# Altium project RFPA_PREAMP.PrjPcb
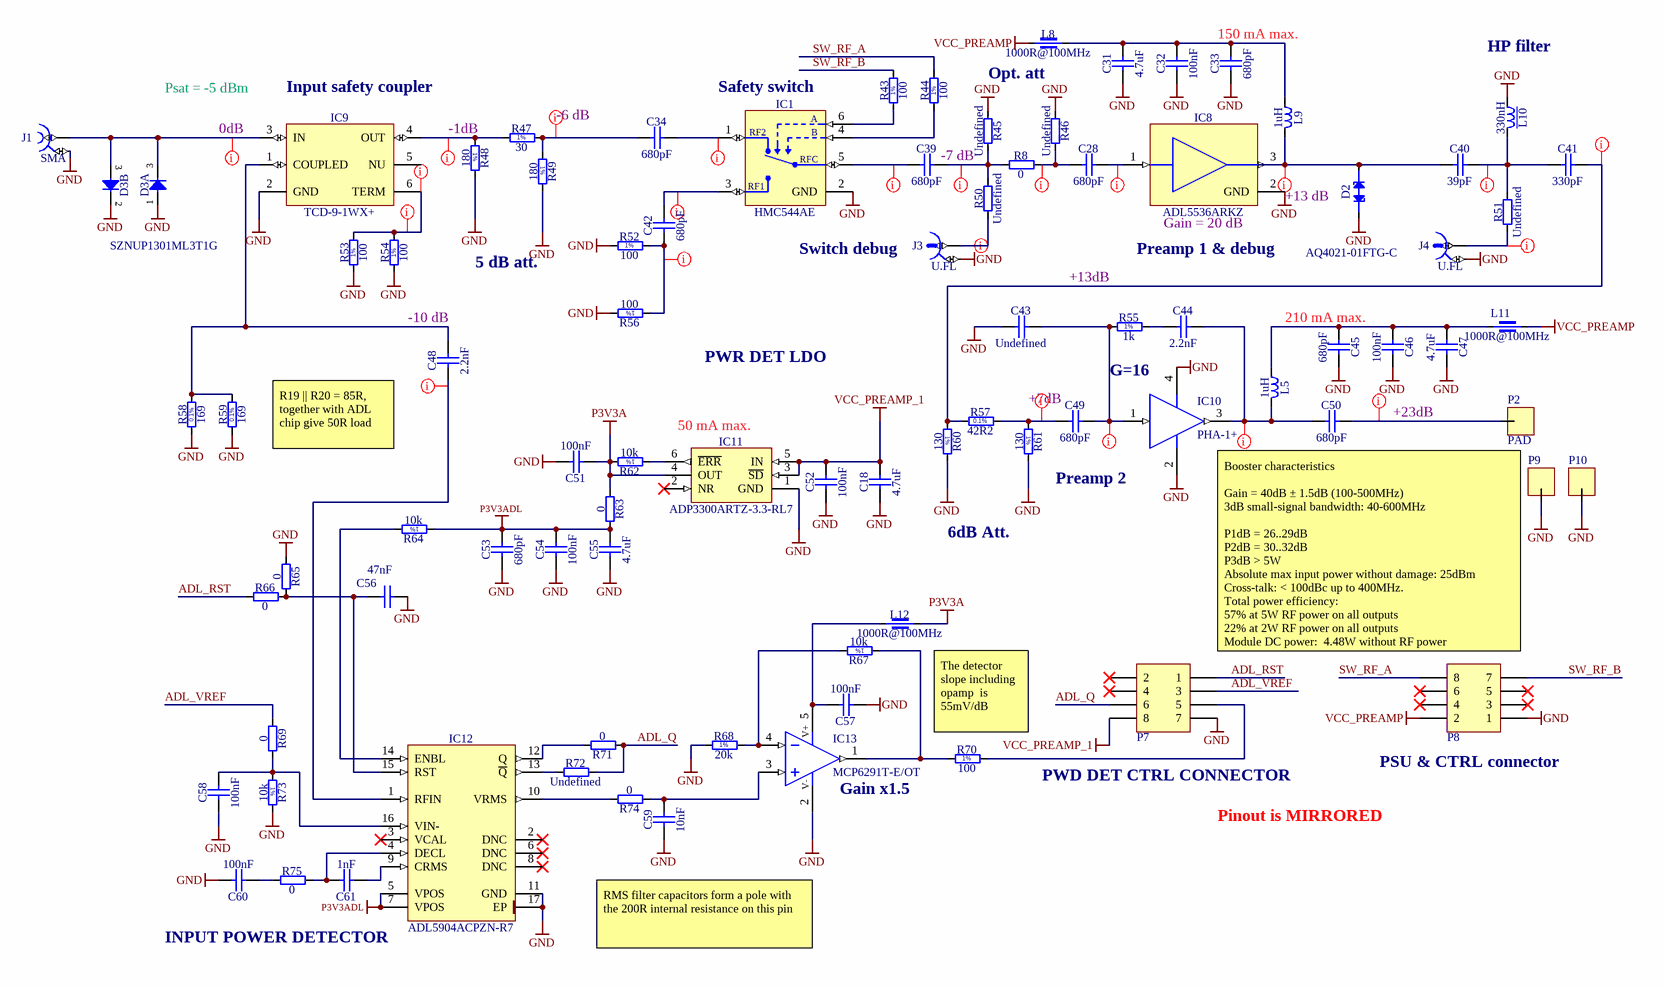
[diagram p0: Booster_PA_PREAMP.SchDoc]
1 sheet, 86 parts. Net scope: global (net labels, ports and power ports of the same name join across sheets).
Board file: Booster_PA_PREAMP.PcbDoc

## Sheet Booster_PA_PREAMP.SchDoc: Booster
size 420 x 297 mm; Comments: Preamplifier circuit design for RFPA; Wersja: 1.41; CustomerInfo: Technosystem sp. z.o.o; CustomerAddress: ul. Okulickiego 7/9 05-500 Piaseczno, NIP 1231350775; CopyrightBy: Maciej Urbanski; CopyrightDate: 2018; TopSheet: RFPA_PREAMP; CurrentSheet: RFPA_PREAMP; Author: G.Kasprowicz; CompanyName: WUT ISE; DrawnBy: G.Kasprowicz; Organization: WUT ISE; Address1: PW ISE; Address2: Nowowiejska 15/19 00-665 Warsaw; Address3: gkasprow@gmail.com; Revision: 2; SheetNumber: -; SheetTotal: -; ModifiedBy: -; CheckedDate: -; Title2: RF Preamplifier; DivGrp: WUT ISE; Designer: M.U.; ModifiedDate: -; ProjectName: Sensor Box

### Parts
C18  4.7uF  [CAPC1709X95N]
C28  680pF  [CAPC1608X87N]
C31  4.7uF  [CAPC1709X95N]
C32  100nF  [CAPC1608X87N]
C33  680pF  [CAPC1608X87N]
C34  680pF  [CAPC1608X87N]
C39  680pF  [CAPC1608X87N]
C40  39pF  [CAPC1608X87N]
C41  330pF  [CAPC1608X87N]
C42  680pF  [CAPC1608X87N]
C43  Undefined  [CAPC1608X90N]
C44  2.2nF  [CAPC1608X87N]
C45  680pF  [CAPC1608X87N]
C46  100nF  [CAPC1608X87N]
C47  4.7uF  [CAPC1709X95N]
C48  2.2nF  [CAPC1608X87N]
C49  680pF  [CAPC1608X87N]
C50  680pF  [CAPC1608X87N]
C51  100nF  [CAPC1608X87N]
C52  100nF  [CAPC1608X87N]
C53  680pF  [CAPC1608X87N]
C54  100nF  [CAPC1608X87N]
C55  4.7uF  [CAPC1709X95N]
C56  47nF  [CAPC1608X87N]
C57  100nF  [CAPC1608X87N]
C58  100nF  [CAPC1608X87N]
C59  10nF  [CAPC1005X55N]
C60  100nF  [CAPC1608X87N]
C61  1nF  [CAPC1005X55N]
D2  AQ4021-01FTG-C  [SOD2513X114N]
D3  SZNUP1301ML3T1G  [SOT95P240X110-3N]  (value not drawn)  (parts A,B of 2)
IC1  HMC544AE  [SOT95P280X145-6N]
IC8  ADL5536ARKZ  [ANALOG-DEVICES_SOT-89(RK-3)]
IC9  TCD-9-1WX+  [MINI-CIRCUITS_DB1627]
IC10  PHA-1+  [MINI-CIRCUITS_DF782]
IC11  ADP3300ARTZ-3.3-RL7  [SOT95P280X145-6N]
IC12  ADL5904ACPZN-R7  [QFN50P300X300X80-17N-S175]
IC13  MCP6291T-E/OT  [SOT95P270X145-5N]
J1  SMA  [LINK_CONSMA002-SMD-G]
J3  U.FL  [HIROSE_U.FL-R-SMT-1(10)]
J4  U.FL  [HIROSE_U.FL-R-SMT-1(10)]
L5  1uH  [IND_ABRACON_AISC-1008]
L8  1000R@100MHz  [INDC1608X95N]
L9  1uH  [IND_ABRACON_AISC-1008]
L10  330nH  [IND_COILCRAFT_0603LS]
L11  1000R@100MHz  [INDC1608X95N]
L12  1000R@100MHz  [INDC1608X95N]
P2  PAD  [PAD_2x3_rect]
P7  HDR2X4  [HDR2X4_SMD]  (value not drawn)
P8  HDR2X4  [HDR2X4_SMD]  (value not drawn)
P9  PAD  [PAD_2x3_rect]  (value not drawn)
P10  PAD  [PAD_2x3_rect]  (value not drawn)
R8  0  [RESC1005X40N]
R43  100  [RESC1608X55N]
R44  100  [RESC1608X55N]
R45  Undefined  [RESC1608X55N]
R46  Undefined  [RESC1608X55N]
R47  30  [RESC1608X55N]
R48  180  [RESC1608X55N]
R49  180  [RESC1608X55N]
R50  Undefined  [RESC1608X55N]
R51  Undefined  [RESC1608X55N]
R52  100  [RESC1608X55N]
R53  100  [RESC1608X55N]
R54  100  [RESC1608X55N]
R55  1k  [RESC1608X55N]
R56  100  [RESC1608X55N]
R57  42R2  [RESC1608X55N]
R58  169  [RESC1608X55N]
R59  169  [RESC1608X55N]
R60  130  [RESC1608X55N]
R61  130  [RESC1608X55N]
R62  10k  [RESC1005X40N]
R63  0  [RESC1005X40N]
R64  10k  [RESC1005X40N]
R65  0  [RESC1005X40N]
R66  0  [RESC1005X40N]
R67  10k  [RESC1005X40N]
R68  20k  [RESC1608X55N]
R69  0  [RESC1005X40N]
R70  100  [RESC1608X55N]
R71  0  [RESC1005X40N]
R72  Undefined  [RESC1608X55N]
R73  10k  [RESC1005X40N]
R74  0  [RESC1005X40N]
R75  0  [RESC1005X40N]

### Nets
GND: C18.1 C31.1 C32.1 C33.1 C43.1 C45.1 C46.1 C47.1 C51.2 C52.1 C53.1 C54.1 C55.1 C56.2 C57.1 C58.1 C59.1 C60.2 D2.1(C) D3.1(A) D3.2(C) IC1.2(GND) IC8.2(GND) IC9.2(GND) IC10.2(GND) IC10.4(GND) IC11.1(GND) IC12.11(GND) IC12.17(EP) IC13.2(V-) J1.2 J3.2 J4.2 L10.1 P7.7 P8.1 P9.1 P10.1 R45.1 R46.1 R48.2 R49.2 R52.1 R53.1 R54.1 R56.2 R58.1 R59.1 R60.2 R61.2 R65.1 R68.1 R73.2
P3V3A: C51.1 IC11.4(OUT) L12.2 R62.2 R63.1
P3V3ADL: C53.2 C54.2 C55.2 IC12.5(VPOS) IC12.7(VPOS) R63.2 R64.1
VCC_PREAMP: L8.1 L11.2 P8.2
VCC_PREAMP_1: C18.2 C52.2 IC11.3(~{SD}) IC11.5(IN) P7.8
ADL_Q: P7.6 R71.1 R72.2
ADL_RST: P7.1 R66.1
ADL_VREF: P7.3 R69.1
SW_RF_A: P8.8 R44.2
SW_RF_B: P8.7 R43.2
NetC28_1: C28.1 R8.2 R46.2
NetC28_2: C28.2 IC8.1(RFIN)
NetC31_2: C31.2 C32.2 C33.2 L8.2 L9.1
NetC34_1: C34.1 R47.2 R49.1
NetC34_2: C34.2 IC1.1(RF2)
NetC39_1: C39.1 IC1.5(RFC)
NetC39_2: C39.2 R8.1 R45.2 R50.2
NetC40_1: C40.1 D2.2(A) IC8.3(RFOUT) L9.2
NetC40_2: C40.2 C41.1 L10.2 R51.2
NetC41_2: C41.2 R57.1 R60.1
NetC42_1: C42.1 R52.2 R56.1
NetC42_2: C42.2 IC1.3(RF1)
NetC43_2: C43.2 C49.2 IC10.1(RF_IN) R55.1
NetC44_1: C44.1 R55.2
NetC44_2: C44.2 C50.1 IC10.3(RF_OUT) L5.2
NetC45_2: C45.2 C46.2 C47.2 L5.1 L11.1
NetC48_1: C48.1 IC12.1(RFIN)
NetC48_2: C48.2 IC9.1(COUPLED) R58.2 R59.2
NetC49_1: C49.1 R57.2 R61.1
NetC50_2: C50.2 P2.1
NetC56_1: C56.1 IC12.15(RST) R65.2 R66.2
NetC57_2: C57.2 IC13.5(V+) L12.1
NetC58_2: C58.2 IC12.16(VIN-) R69.2 R73.1
NetC59_2: C59.2 IC13.3(IN+) R74.1
NetC60_1: C60.1 R75.1
NetC61_1: C61.1 IC12.9(CRMS)
NetC61_2: C61.2 IC12.4(DECL) R75.2
NetD3_3: D3.3(COMAC) IC9.3(IN) J1.1
NetIC1_4: IC1.4(B) R44.1
NetIC1_6: IC1.6(A) R43.1
NetIC9_4: IC9.4(OUT) R47.1 R48.1
NetIC9_6: IC9.6(TERM) R53.2 R54.2
NetIC11_6: IC11.6(~{ERR}) R62.1
NetIC12_10: IC12.10(VRMS) R74.2
NetIC12_12: IC12.12(Q) R71.2
NetIC12_13: IC12.13(~{Q}) R72.1
NetIC12_14: IC12.14(ENBL) R64.2
NetIC13_1: IC13.1(OUT) R67.1 R70.1
NetIC13_4: IC13.4(IN-) R67.2 R68.2
NetJ3_1: J3.1 R50.1
NetJ4_1: J4.1 R51.1
NetP7_5: P7.5 R70.2

Not connected (* = marked no-connect by the designer): IC9 5(NU); IC11 2(NR)*; IC12 2(DNC)* 3(VCAL)* 6(DNC)* 8(DNC)*; P7 2* 4*; P8 3* 4* 5* 6*

### Layout directives
net class 50_Ohm: NetC28_1, NetC28_2, NetC34_1, NetC34_2, NetC39_1, NetC39_2, NetC40_1, NetC40_2, NetC41_2, NetC42_1, NetC42_2, NetC43_2, NetC44_2, NetC48_1, NetC49_1, NetC50_2, NetD3_3, NetIC9_4, NetIC9_6, NetJ3_1, NetJ4_1

### Notes on the sheet
- (near IC9) Psat = -5 dBm
- Input safety coupler
- (near IC1) Safety switch
- Opt. att
- (near C33) 150 mA max.
- (near L10) HP filter
- (near IC9) 0dB
- (near R48) -1dB
- -6 dB
- -7 dB
- (near IC8) Gain = 20 dB
- +13 dB
- 5 dB att.
- Switch debug
- +13dB
- Preamp 1 & debug
- (near C48) -10 dB
- PWR DET LDO
- (near C45) 210 mA max.
- 50 mA max.
- +7dB
- (near IC10) G=16
- +23dB
- R19 || R20 = 85R, together with ADL chip give 50R load
- Preamp 2
- 6dB Att.
- Booster characteristics
  Gain = 40dB ± 1.5dB (100-500MHz)
  3dB small-signal bandwidth: 40-600MHz
  P1dB = 26..29dB
  P2dB = 30..32dB
  P3dB > 5W
  Absolute max input power without damage: 25dBm
  Cross-talk: < 100dBc up to 400MHz.
  Total power efficiency:
  57% at 5W RF power on all outputs
  22% at 2W RF power on all outputs
  Module DC power:  4.48W without RF power
- The detector slope including opamp  is 55mV/dB
- (near P8) PSU & CTRL connector
- (near IC13) Gain x1.5
- PWD DET CTRL CONNECTOR
- Pinout is MIRRORED
- INPUT POWER DETECTOR
- RMS filter capacitors form a pole with the 200R internal resistance on this pin
- Project/Equipment
- Document
- Designer
- Drawn by
- Check.by
- Copyright WUT ISE 2019.
  This documentation describes Open Hardware and is licensed under the CERN OHL v.1.1. You may redistribute and modify this documentation under the terms of the CERN OHL v.1.1. (http://ohwr.org/CERNOHL). This documentation is distributed WITHOUT ANY EXPRESS OR IMPLIED WARRANTY, INCLUDING OF MERCHANTABILITY, SATISFACTORY QUALITY AND FITNESS FOR A PARTICULAR PURPOSE. Please see the CERN OHL v.1.1 for applicable conditions.
- Contact
- File
- Last Mod.
- Print Date
- Sheet
- Size
- A3
- of
- Rev
- (in symbol R0402_10k_1%_0.0625W_100PPM) 1%
- (in symbol R0603_1K_1%_0.1W_100PPM) 1%
- (in symbol R0603_20K_1%_0.1W_100PPM) 1%
- (in symbol R0603_30R_1%_0.1W_100PPM) 1%
- (in symbol R0603_42R2_0.1%_0.063W_10PPM) 0.1%
- (in symbol R0603_100R_1%_0.1W_100PPM) 1%
- (in symbol R0603_130R_1%_0.1W_100PPM) 1%
- (in symbol R0603_169R_0.1%_0.063W_10PPM) 0.1%
- (in symbol R0603_180R_1%_0.1W_100PPM) 1%

### Library data of the parts
C18 C31 C47 C55 = CC0603_4.7UF_16V_10%_X5R: Non-polarised capacitor; Manufacturer: GENERIC; Part Description: SMD Multilayer Chip Ceramic Capacitor; Manufacturer1 Part Number: EMK107ABJ475KA-T; Voltage: 16V; TC: X5R; Tolerance: ±10%; Value: 4.7uF; Manufacturer Part Number: CC0603_4.7UF_16V_10%_X5R; Part Number: CC0603_4.7UF_16V_10%_X5R; Component Kind: Standard; Component Type: Standard; Pin Count: 2; Status: None; Case: 0603; Mounted: Yes; Socket: No; SMD: Yes; Sense: No; Manufacturer1 Example: TAIYO YUDEN; Manufacturer1 ComponentHeight: 0.95mm; HelpURL: \\cern.ch\dfs\Applications\Altium\Datasheets\CC0603_X7R_TAIYO-YUDEN_HIGH-VALUE.pdf; Author: CERN DEM JLC; CreateDate: 16.12.2013; LatestRevisionDate: 16.09.2014
C28 C33 C34 C39 C42 = CC0603_680PF_50V_5%_NP0: Non-polarised capacitor; Part Description: SMD Multilayer Chip Ceramic Capacitor; Manufacturer: GENERIC; Manufacturer1 Part Number: 223886715681; Voltage: 50V; TC: C0G/NP0; Tolerance: ±5%; Part Number: CC0603_680PF_50V_5%_NP0; Component Kind: Standard; Component Type: Standard; Pin Count: 2; Value: 680pF; Status: Preferred; Manufacturer Part Number: CC0603_680PF_50V_5%_NP0; Case: 0603; Mounted: Yes; Socket: No; SMD: Yes; Sense: No; Manufacturer1 Example: PHYCOMP; Manufacturer1 ComponentHeight: 0.87mm; HelpURL: \\cern.ch\dfs\Applications\Altium\Datasheets\CC0603_NP0_PHYCOMP.pdf; Author: CERN DEM JLC; CreateDate: 03.12.2007; LatestRevisionDate: 03.12.2007
C32 C46 C51 C52 C54 C57 C58 C60 = CC0603_100NF_50V_10%_X7R: Non-polarised capacitor; Manufacturer: GENERIC; Part Description: SMD Multilayer Chip Ceramic Capacitor; Manufacturer1 Part Number: 223858615649; Voltage: 50V; TC: X7R; Tolerance: ±10%; Value: 100nF; Manufacturer Part Number: CC0603_100NF_50V_10%_X7R; Part Number: CC0603_100NF_50V_10%_X7R; Component Kind: Standard; Component Type: Standard; Pin Count: 2; Status: Preferred; Case: 0603; Mounted: Yes; Socket: No; SMD: Yes; Sense: No; Manufacturer1 Example: PHYCOMP; Manufacturer1 ComponentHeight: 0.87mm; HelpURL: \\cern.ch\dfs\Applications\Altium\Datasheets\CC0603_X7R_PHYCOMP.pdf; Author: CERN DEM JLC; CreateDate: 03.12.2007; LatestRevisionDate: 03.12.2007
C40 = CC0603_39PF_50V_1%_NP0: Non-polarised capacitor; Part Number: CC0603_39PF_100V_1%_NP0; Part Description: SMD Multilayer Chip Ceramic Capacitor; Manufacturer: GENERIC; Manufacturer1 Part Number: 06031A390FAT2A; Voltage: 100V; TC: C0G/NP0; Tolerance: ±1%; Component Kind: Standard; Component Type: Standard; Pin Count: 2; Value: 39pF; Status: Preferred; Manufacturer Part Number: CC0603_39PF_100V_1%_NP0; Case: 0603; Mounted: Yes; Socket: No; SMD: Yes; Sense: No; Manufacturer1 Example: AVX; Manufacturer1 ComponentHeight: 0.87mm; HelpURL: \\cern.ch\dfs\Applications\Altium\Datasheets\CC0603_NP0_PHYCOMP.pdf; Author: GK; CreateDate: 03.12.2007; LatestRevisionDate: 03.12.2007
C41 = CC0603_330PF_50V_1%_NP0: Non-polarised capacitor; Manufacturer: GENERIC; Part Description: SMD Multilayer Chip Ceramic Capacitor; Manufacturer1 Part Number: 223886718331; Voltage: 50V; TC: C0G/NP0; Tolerance: ±1%; Value: 330pF; Manufacturer Part Number: CC0603_330PF_50V_1%_NP0; Part Number: CC0603_330PF_50V_1%_NP0; Component Kind: Standard; Component Type: Standard; Pin Count: 2; Status: None; Case: 0603; Mounted: Yes; Socket: No; SMD: Yes; Sense: No; Manufacturer1 Example: PHYCOMP; Manufacturer1 ComponentHeight: 0.87mm; HelpURL: \\cern.ch\dfs\Applications\Altium\Datasheets\CC0603_NP0_PHYCOMP.pdf; Author: CERN DEM MR; CreateDate: 06.09.2017; LatestRevisionDate: 06.09.2017
C43 = CC0603_NO-VALUE: Non-polarised capacitor; Part Description: Reserved Footprint For 0603(1608) Chip Ceramic Capacitor; Mounted: No; Part Number: CC0603_NO-VALUE; Component Kind: Standard; Component Type: Standard; Pin Count: 2; Value: Undefined; Status: None; Manufacturer: Undefined; Manufacturer Part Number: CC0603_NO-VALUE; Case: 0603; Socket: No; SMD: Yes; Sense: No; Manufacturer1 ComponentHeight: 0.9mm; HelpURL: Undefined; Author: CERN DEM MR; CreateDate: 22.11.2016; LatestRevisionDate: 22.11.2016
C44 C48 = CC0603_2.2NF_50V_5%_C0G: Non-polarised capacitor; Part Description: SMD Multilayer Chip Ceramic Capacitor; Manufacturer: GENERIC; Manufacturer1 Part Number: C1608C0G1H222J080AA; Voltage: 50V; TC: C0G/NP0; Tolerance: ±5%; Part Number: CC0603_2.2NF_50V_5%_C0G; Component Kind: Standard; Component Type: Standard; Pin Count: 2; Value: 2.2nF; Status: Preferred; Manufacturer Part Number: CC0603_2.2NF_50V_5%_C0G; Case: 0603; Mounted: Yes; Socket: No; SMD: Yes; Sense: No; Manufacturer1 Example: TDK; Manufacturer1 ComponentHeight: 0.9mm; HelpURL: \\cern.ch\dfs\Applications\Altium\Datasheets\CC0603_C0G_TDK_C.pdf; Author: CERN DEM JMW; CreateDate: 23.06.2014; LatestRevisionDate: 23.06.2014
C45 C49 C50 C53 = CC0603_680PF_50V_5%_NP0: Non-polarised capacitor; Manufacturer: GENERIC; Part Description: SMD Multilayer Chip Ceramic Capacitor; Manufacturer1 Part Number: 223886715681; Voltage: 50V; TC: C0G/NP0; Tolerance: ±5%; Value: 680pF; Manufacturer Part Number: CC0603_680PF_50V_5%_NP0; Part Number: CC0603_680PF_50V_5%_NP0; Component Kind: Standard; Component Type: Standard; Pin Count: 2; Status: Preferred; Case: 0603; Mounted: Yes; Socket: No; SMD: Yes; Sense: No; Manufacturer1 Example: PHYCOMP; Manufacturer1 ComponentHeight: 0.87mm; HelpURL: \\cern.ch\dfs\Applications\Altium\Datasheets\CC0603_NP0_PHYCOMP.pdf; Author: CERN DEM JLC; CreateDate: 03.12.2007; LatestRevisionDate: 03.12.2007
C56 = CC0603_47NF_25V_10%_X7R: Non-polarised capacitor; Part Description: SMD Multilayer Chip Ceramic Capacitor; Manufacturer: GENERIC; Manufacturer1 Part Number: 223891615645; Voltage: 25V; TC: X7R; Tolerance: ±10%; Part Number: CC0603_47NF_25V_10%_X7R; Component Kind: Standard; Component Type: Standard; Pin Count: 2; Value: 47nF; Status: Preferred; Manufacturer Part Number: CC0603_47NF_25V_10%_X7R; Case: 0603; Mounted: Yes; Socket: No; SMD: Yes; Sense: No; Manufacturer1 Example: PHYCOMP; Manufacturer1 ComponentHeight: 0.87mm; HelpURL: \\cern.ch\dfs\Applications\Altium\Datasheets\CC0603_X7R_PHYCOMP.pdf; Author: CERN DEM JLC; CreateDate: 03/12/2007; LatestRevisionDate: 03/12/2007
C59 = CC0402_10NF_25V_10%_X7R: Non-polarised capacitor; Manufacturer: GENERIC; Part Description: SMD Multilayer Chip Ceramic Capacitor; Manufacturer1 Part Number: C1005X7R1E103KT; Voltage: 25V; TC: X7R; Tolerance: ±10%; Value: 10nF; Manufacturer Part Number: CC0402_10NF_25V_10%_X7R; Part Number: CC0402_10NF_25V_10%_X7R; Component Kind: Standard; Component Type: Standard; Pin Count: 2; Status: Preferred; Case: 0402; Mounted: Yes; Socket: No; SMD: Yes; Sense: No; Manufacturer1 Example: TDK; Manufacturer1 ComponentHeight: 0.55mm; HelpURL: \\cern.ch\dfs\Applications\Altium\Datasheets\CC0402_X7R_TDK_C.pdf; Author: CERN DEM JLC; CreateDate: 25.10.2012; LatestRevisionDate: 25.10.2012
C61 = CC0402_1NF_50V_10%_X7R: Non-polarised capacitor; Part Description: SMD Multilayer Chip Ceramic Capacitor; Manufacturer: GENERIC; Manufacturer1 Part Number: 223858715623; Voltage: 50V; TC: X7R; Tolerance: ±10%; Part Number: CC0402_1NF_50V_10%_X7R; Component Kind: Standard; Component Type: Standard; Pin Count: 2; Value: 1nF; Status: Not Recommended; Manufacturer Part Number: CC0402_1NF_50V_10%_X7R; Case: 0402; Mounted: Yes; Socket: No; SMD: Yes; Sense: No; Manufacturer1 Example: PHYCOMP; Manufacturer1 ComponentHeight: 0.55mm; HelpURL: \\cern.ch\dfs\Applications\Altium\Datasheets\CC0402_X7R_PHYCOMP.pdf; Author: CERN DEM JLC; CreateDate: 03.12.2007; LatestRevisionDate: 03.12.2007
D2 = D_TVS_AQ4021-01FTG-C: 6V Bi-directional,ESD Protection for Transient Voltage Suppressor Diode; Part Description: Bi-directional ESD Protection for Transient Voltage Suppressor Diode; Manufacturer: Littlefuse; Power: 450W; PressFit: No; Bonding: No; Part Number: AQ4021-01FTG-C; Component Kind: Standard; Component Type: Standard; Device: AQ4021-01FTG-C; PackageDescription: SOD-323 Diode; 1.75mm W X 1.30mm L X 1.14mm H Body, IPC Medium Density; Voltage: 6V; Manufacturer Part Number: AQ4021-01FTG-C; Pin Count: 2; Case: SOD323; Mounted: Yes; Socket: No; SMD: Yes; Sense: No; ComponentHeight: 1.14mm; HelpURL: \\cern.ch\dfs\Applications\Altium\Datasheets\CDSOD323-T12C-DSL.pdf; Author: GK; CreateDate: 22.07.2015; LatestRevisionDate: 19.12.2017
D3 = D_TVS_SZNUP1301ML3T1G: Low Capacitance Diode Array for ESD Protection in a Single Data Line; Manufacturer: ONSEMI; Voltage: 70V; Power: 215mA; PressFit: No; Bonding: No; Part Number: SZNUP1301ML3T1G; Component Kind: Standard; Component Type: Standard; Device: SZNUP1301ML3T1G; PackageDescription: SOT23 3-Leads, Pitch 0.95mm - Body 1.3x2.9mm, IPC Medium Density; Part Description: Low Capacitance Diode Array for ESD Protection in a Single Data Line; Manufacturer Part Number: SZNUP1301ML3T1G; Pin Count: 3; Case: SOT23; Mounted: Yes; Socket: No; SMD: Yes; Sense: No; ComponentHeight: 1.1mm; HelpURL: \\cern.ch\dfs\Applications\Altium\Datasheets\BAR66.pdf; Author: GK; CreateDate: 18.01.2010; LatestRevisionDate: 05.10.2010
IC1 = HMC544AE: GaAs MMIC T/R Switch DC - 4 GHz; Manufacturer: ANALOG DEVICES; PressFit: No; Bonding: No; Part Number: HMC544AE; Component Kind: Standard; Component Type: Standard; Device: HMC544AE; PackageDescription: SOT23, 6-Leads, Body 1.6x3.0mm, Pitch 0.95mm, IPC Medium Density; Part Description: GaAs MMIC T/R Switch DC - 4 GHz; Manufacturer Part Number: HMC544AE; Pin Count: 6; Case: SOT23-6; Mounted: Yes; Socket: No; SMD: Yes; Sense: No; ComponentHeight: 1.45mm; Author: CERN DEM MR; HelpURL: \\cern.ch\dfs\Applications\Altium\Datasheets\HMC544AE.pdf; CreateDate: 26.09.2017; LatestRevisionDate: 26.09.2017
IC8 = ADL5536ARKZ: 20MHz to 1GHz IF Gain Block; Manufacturer: ANALOG DEVICES; PressFit: No; Bonding: No; Part Number: ADL5536ARKZ; Component Kind: Standard; Component Type: Standard; Device: ADL5536ARKZ; PackageDescription: SOT89, 1.50mm Pitch; 3-Leads, 2.5mm W X 4.5mm L X 1.6mm H body; Part Description: 20MHz to 1GHz IF Gain Block; Manufacturer Part Number: ADL5536ARKZ; Pin Count: 4; Case: SOT89; Mounted: Yes; Socket: No; SMD: Yes; Sense: No; ComponentHeight: 1.6mm; Author: CERN DEM BC; HelpURL: \\cern.ch\dfs\Applications\Altium\Datasheets\ADL5536ARKZ.pdf; CreateDate: 19.08.2019; LatestRevisionDate: 19.08.2019
IC9 = TCD-9-1WX+: 50 Ohm, 5 To 2000MHz, Directional Coupler; Part Description: 50 Ohms, 5 To 2000MHz, Directional Coupler; Manufacturer: MINI-CIRCUITS; PressFit: No; Bonding: No; Part Number: TCD-9-1WX+; Component Kind: Standard; Component Type: Standard; Device: TCD-9-1WX+; PackageDescription: MINI-CIRCUITS Case Style DB1627 - Body 4.06X3.81mm; Manufacturer Part Number: TCD-9-1WX+; Pin Count: 6; Mounted: Yes; Socket: No; SMD: Yes; Sense: No; ComponentHeight: 4.06mm; Author: CERN DEM BC; HelpURL: \\cern.ch\dfs\Applications\Altium\Datasheets\TCD-9-1WX+.pdf; CreateDate: 22.08.2019; LatestRevisionDate: 22.08.2019
IC10 = PHA-1+: Monolithic Amplifier; Part Description: 0.05-6GHz Surface Mount Monolithic Amplifier; Manufacturer: MINI-CIRCUITS; PressFit: No; Bonding: No; Part Number: PHA-1+; Component Kind: Standard; Component Type: Standard; Device: PHA-1+; PackageDescription: MINI-CIRCUITS DF782 Case, 1.50mm pitch; 4 pin, 2.44mm W X 4.49mm L; Manufacturer Part Number: PHA-1+; Pin Count: 4; Mounted: Yes; Socket: No; SMD: Yes; Sense: No; ComponentHeight: 1.6mm; Author: CERN DEM BC; HelpURL: \\cern.ch\dfs\Applications\Altium\Datasheets\PHA-1+.pdf; CreateDate: 22.08.2019; LatestRevisionDate: 22.08.2019
IC11 = ADP3300ARTZ-3.3-RL7: High Accuracy anyCAP® 50 mA Low Dropout Linear Regulator; Part Description: 3.3V High Accuracy anyCAP® 50 Ma Low Dropout Linear Regulator; Manufacturer: ANALOG DEVICES; PressFit: No; Bonding: No; Part Number: ADP3300ARTZ-3.3-RL7; Component Kind: Standard; Component Type: Standard; Device: ADP3300ARTZ-3.3-RL7; PackageDescription: SOT23, 0.95mm pitch; 6 pin, 1.6mm W X 2.9mm L X 1.45mm H body, IPC Medium Density; Manufacturer Part Number: ADP3300ARTZ-3.3-RL7; Pin Count: 6; Case: SOT23-6; Mounted: Yes; Socket: No; SMD: Yes; Sense: No; ComponentHeight: 1.45mm; HelpURL: \\cern.ch\dfs\Applications\Altium\Datasheets\ADP3300ARTZ-3.3-RL7.pdf; Author: CERN DEM JLC; CreateDate: 30.11.2011; LatestRevisionDate: 30.11.2011
IC12 = ADL5904ACPZN-R7: DC to 6 GHz, 45 dB TruPwr Detector With Envelope Threshold Detection; Manufacturer: ANALOG DEVICES; PressFit: No; Bonding: No; Part Number: ADL5904ACPZN-R7; Component Kind: Standard; Component Type: Standard; Device: ADL5904ACPZN-R7; PackageDescription: QFN, 0.50mm Pitch, Square; 16 Pin, 3.00mm L X 3.00mm W X 0.80mm H Body (w/Thermal Tab 1.75 X 1.75mm),  IPC Medium Density; Part Description: DC to 6 GHz, 45 dB TruPwr Detector With Envelope Threshold Detection; Manufacturer Part Number: ADL5904ACPZN-R7; Pin Count: 17; Case: QFN16; Mounted: Yes; Socket: No; SMD: Yes; Sense: No; ComponentHeight: 0.8mm; Author: CERN DEM MR; HelpURL: \\cern.ch\dfs\Applications\Altium\Datasheets\ADL5904ACPZN-R7.pdf; CreateDate: 26.09.2017; LatestRevisionDate: 26.09.2017
IC13 = MCP6291T-E/OT: Operational Amplifier; Part Description: 1.0mA, 10 MHz Rail-to-Rail Operational Amplifier; Manufacturer: MICROCHIP TECHNOLOGY; PressFit: No; Bonding: No; Part Number: MCP6291T-E/OT; Component Kind: Standard; Component Type: Standard; Device: MCP6291T-E/OT; PackageDescription: SOT, 0.95mm pitch; 5 pin, 1.55mm W X 2.90mm L X 1.45mm H body, IPC Medium Density; Manufacturer Part Number: MCP6291T-E/OT; Pin Count: 5; Case: SOT23-5; Mounted: Yes; Socket: No; SMD: Yes; Sense: No; ComponentHeight: 1.45mm; Author: CERN DEM BC; HelpURL: \\cern.ch\dfs\Applications\Altium\Datasheets\MCP6291T-E-OT.pdf; CreateDate: 22.08.2019; LatestRevisionDate: 22.08.2019
J1 = LINK_CONSMA002-SMD-G: Part Description: SMA Female Right Angled - Surface Mount; Manufacturer: LINK TECHNOLOGIES; PressFit: No; Part Number: LINK_CONSMA002-SMD-G; Component Kind: Standard; Component Type: Standard; Pin Count: 2; Family: SMA; Mounted: Yes; Socket: No; SMD: Yes; Sense: No; Status: None; Manufacturer Part Number: CONSMA002-SMD-G; ComponentHeight: 10.8mm; HelpURL: \\cern.ch\dfs\Applications\Altium\Datasheets\LINK_CONSMA002-SMD-G.pdf; Author: CERN DEM BC; CreateDate: 28.08.2019; LatestRevisionDate: 28.08.2019
J3 J4 = HIROSE_U.FL-R-SMT-1(10): Part Description: Up to 6GHz Ultra Small Surface Mount Male Coaxial Connectors U.FL Series; Manufacturer: HIROSE (HRS); PressFit: No; Part Number: HIROSE_U.FL-R-SMT-1(10); Component Kind: Standard; Component Type: Standard; Pin Count: 2; Family: U.FL; Mounted: Yes; Socket: No; SMD: Yes; Sense: No; Status: None; Manufacturer Part Number: U.FL-R-SMT-1(10); ComponentHeight: 1.25mm; HelpURL: \\cern.ch\dfs\Applications\Altium\Datasheets\HIROSE_U.FL-R-SMT-1(10).pdf; Author: CERN DEM JLC; CreateDate: 24.03.2010; LatestRevisionDate: 24.03.2010
L5 L9 = IND_1UH_2%_ABRACON_AISC-1008: Inductor; Part Description: SMD Ceramic Wire-Wound Chip Inductor; Manufacturer Part Number: AISC-1008-1R0G; Power: 370mA; Resistance: 1.8R; Tolerance: ±2%; Part Number: IND_1UH_2%_ABRACON_AISC-1008; Component Kind: Standard; Component Type: Standard; Pin Count: 2; Value: 1uH; Status: None; Manufacturer: ABRACON; Case: 1008; Mounted: Yes; Socket: No; SMD: Yes; Sense: No; ComponentHeight: 2.29mm; HelpURL: \\cern.ch\dfs\Applications\Altium\Datasheets\IND_ABRACON_AISC-1008.pdf; Author: CERN DEM BC; CreateDate: 26.08.2019; LatestRevisionDate: 26.08.2019
L8 L11 L12 = IND0603_MURATA_BLM18HE102SN1: Manufacturer: MURATA; Part Description: SMD EMIFIL Suppression Chip Ferrite Bead; Power: 600mA; Resistance: 0.35R; Tolerance: ±25%; Value: 1000R@100MHz; Manufacturer Part Number: BLM18HE102SN1; Part Number: IND0603_MURATA_BLM18HE102SN1; Component Kind: Standard; Component Type: Standard; Pin Count: 2; Status: None; Case: 0603; Mounted: Yes; Socket: No; SMD: Yes; Sense: No; ComponentHeight: 0.95mm; HelpURL: \\cern.ch\dfs\Applications\Altium\Datasheets\IND0603_MURATA_BLM18H.pdf; Author: CERN DEM JLC; CreateDate: 09.12.2013; LatestRevisionDate: 25.10.2018
L10 = IND_330NH_2%_COILCRAFT_0603LS: Inductor With Core; Part Description: SMT Chip Inductor; Manufacturer Part Number: 0603LS-331XGL; Power: 560mA; Resistance: 0R46; Tolerance: ±2%; Part Number: IND_330NH_2%_COILCRAFT_0603LS; Component Kind: Standard; Component Type: Standard; Pin Count: 2; Value: 330nH; Status: None; Manufacturer: COILCRAFT; Case: 0603; Mounted: Yes; Socket: No; SMD: Yes; Sense: No; ComponentHeight: 1.12mm; HelpURL: \\cern.ch\dfs\Applications\Altium\Datasheets\IND_COILCRAFT_0603LS.pdf; Author: CERN DEM BC; CreateDate: 29.08.2019; LatestRevisionDate: 29.08.2019
P2 P9 P10 = PAD: Generic: no; Remarks: PCB PAD; Value: -; Manufacturer: -; Manufacturer Part Number: -; Mounting type: -; Package: -; Supplier 1: -; Supplier 2: -; Supplier 3: -; Supplier Part Number 1: -; Supplier Part Number 2: -; Supplier Part Number 3: -
P7 P8 = HDR2X4: Header, 4-Pin, Dual Row; Value: should be fixed with thermal glue; Generic: yes; Remarks: ordinary goldpin socket; Manufacturer: -; Manufacturer Part Number: -; Mounting type: SMT; Package: 2x4 pin SMD; Supplier 1: TME; Supplier 2: -; Supplier 3: -; Supplier Part Number 1: ZL264-8DG; Supplier Part Number 2: -; Supplier Part Number 3: -
R8 R63 R65 R66 R69 R71 R74 R75 = R0402_0R_JUMPER: Resistor; Manufacturer: GENERIC; Part Description: 1A (0.05R Max DC Resistance) Zero Ohm Jumper; Manufacturer1 Part Number: 232270591001L; PressFit: No; Value: 0; Manufacturer Part Number: R0402_0R_JUMPER; Part Number: R0402_0R_JUMPER; Component Kind: Standard; Component Type: Standard; Pin Count: 2; Status: Not Recommended; Case: 0402; Mounted: Yes; Sense: No; Socket: No; SMD: Yes; Manufacturer1 Example: YAGEO PHYCOMP; Manufacturer1 ComponentHeight: 0.4mm; HelpURL: \\cern.ch\dfs\Applications\Altium\Datasheets\R0402_Phycomp_RC0402.pdf; Author: CERN DEM JLC; CreateDate: 03.12.2007; LatestRevisionDate: 17.10.2012
R43 R44 R52-R54 R56 R70 = R0603_100R_1%_0.1W_100PPM: Resistor - 1%; Manufacturer: GENERIC; Part Description: General Purpose Thick Film Chip Resistor; Manufacturer1 Part Number: NRC06F4700TRF; Power: 0.1W; TC: ±100ppm/°C; PressFit: No; Value: 100; Manufacturer Part Number: R0603_100R_1%_0.1W_100PPM; Part Number: R0603_100R_1%_0.1W_100PPM; Component Kind: Standard; Component Type: Standard; Pin Count: 2; Status: Preferred; Tolerance: ±1%; Case: 0603; Mounted: Yes; Sense: No; Socket: No; SMD: Yes; Manufacturer1 Example: NIC COMPONENT; Manufacturer1 ComponentHeight: 0.55mm; HelpURL: \\cern.ch\dfs\Applications\Altium\Datasheets\R0603_NIC_NRC.pdf; Author: CERN DEM JLC; CreateDate: 03.12.2007; LatestRevisionDate: 13.03.2008
R45 R46 R50 R51 R72 = R0603_NO-VALUE: Resistor; Part Description: Reserved Footprint For a 0603 (1608) Chip Resistor; PressFit: No; Mounted: No; Value: Undefined; Manufacturer: Undefined; Manufacturer Part Number: R0603_NO-VALUE; Part Number: R0603_NO-VALUE; Component Kind: Standard; Component Type: Standard; Pin Count: 2; Status: None; Case: 0603; Sense: No; Socket: No; SMD: Yes; Manufacturer1 Example: Undefined; Manufacturer1 Part Number: Undefined; Manufacturer1 ComponentHeight: Undefined; HelpURL: Undefined; Author: CERN DEM JLC; CreateDate: 03.12.2007; LatestRevisionDate: 13.03.2008
R47 = R0603_30R_1%_0.1W_100PPM: Resistor - 1%; Part Description: General Purpose Thick Film Chip Resistor; Manufacturer: GENERIC; Manufacturer1 Part Number: NRC06F30R0TRF; Power: 0.1W; TC: ±100ppm/°C; PressFit: No; Part Number: R0603_30R_1%_0.1W_100PPM; Component Kind: Standard; Component Type: Standard; Pin Count: 2; Value: 30; Status: Preferred; Tolerance: ±1%; Manufacturer Part Number: R0603_30R_1%_0.1W_100PPM; Case: 0603; Mounted: Yes; Sense: No; Socket: No; SMD: Yes; Manufacturer1 Example: NIC COMPONENT; Manufacturer1 ComponentHeight: 0.55mm; HelpURL: \\cern.ch\dfs\Applications\Altium\Datasheets\R0603_NIC_NRC.pdf; Author: CERN DEM JLC; CreateDate: 03.12.2007; LatestRevisionDate: 13.03.2008
R48 R49 = R0603_180R_1%_0.1W_100PPM: Resistor - 1%; Manufacturer: GENERIC; Part Description: General Purpose Thick Film Chip Resistor; Manufacturer1 Part Number: NRC06F1800TRF; Power: 0.1W; TC: ±100ppm/°C; PressFit: No; Value: 180; Manufacturer Part Number: R0603_180R_1%_0.1W_100PPM; Part Number: R0603_180R_1%_0.1W_100PPM; Component Kind: Standard; Component Type: Standard; Pin Count: 2; Status: Preferred; Tolerance: ±1%; Case: 0603; Mounted: Yes; Sense: No; Socket: No; SMD: Yes; Manufacturer1 Example: NIC COMPONENT; Manufacturer1 ComponentHeight: 0.55mm; HelpURL: \\cern.ch\dfs\Applications\Altium\Datasheets\R0603_NIC_NRC.pdf; Author: CERN DEM JLC; CreateDate: 03.12.2007; LatestRevisionDate: 13.03.2008
R55 = R0603_1K_1%_0.1W_100PPM: Resistor - 1%; Manufacturer: GENERIC; Part Description: General Purpose Thick Film Chip Resistor; Manufacturer1 Part Number: NRC06F1001TRF; Power: 0.1W; TC: ±100ppm/°C; PressFit: No; Value: 1k; Manufacturer Part Number: R0603_1K_1%_0.1W_100PPM; Part Number: R0603_1K_1%_0.1W_100PPM; Component Kind: Standard; Component Type: Standard; Pin Count: 2; Status: Preferred; Tolerance: ±1%; Case: 0603; Mounted: Yes; Sense: No; Socket: No; SMD: Yes; Manufacturer1 Example: NIC COMPONENT; Manufacturer1 ComponentHeight: 0.55mm; HelpURL: \\cern.ch\dfs\Applications\Altium\Datasheets\R0603_NIC_NRC.pdf; Author: CERN DEM JLC; CreateDate: 03.12.2007; LatestRevisionDate: 13.03.2008
R57 = R0603_42R2_0.1%_0.063W_10PPM: Resistor - 0.1%; Part Description: Thin Film Chip Resistor; Manufacturer: GENERIC; Manufacturer1 Part Number: RN73C1J42R2BTDF; Power: 0.063W; TC: ±10ppm; PressFit: No; Part Number: R0603_42R2_0.1%_0.063W_10PPM; Component Kind: Standard; Component Type: Standard; Pin Count: 2; Value: 42R2; Status: Not Recommended; Tolerance: ±0.1%; Manufacturer Part Number: R0603_42R2_0.1%_0.063W_10PPM; Case: 0603; Mounted: Yes; Sense: No; Socket: No; SMD: Yes; Manufacturer1 Example: TYCO HOLSWORTHY; Manufacturer1 ComponentHeight: 0.5mm; HelpURL: \\cern.ch\dfs\Applications\Altium\Datasheets\R0603_Tyco_RN73.pdf; Author: CERN DEM JLC; CreateDate: 03.12.2007; LatestRevisionDate: 13.03.2008
R58 R59 = R0603_169R_0.1%_0.063W_10PPM: Resistor - 0.1%; Part Description: Thin Film Chip Resistor; Manufacturer: GENERIC; Manufacturer1 Part Number: RN73C1J169RBTDF; Power: 0.063W; TC: ±10ppm; PressFit: No; Part Number: R0603_169R_0.1%_0.063W_10PPM; Component Kind: Standard; Component Type: Standard; Pin Count: 2; Value: 169; Status: Not Recommended; Tolerance: ±0.1%; Manufacturer Part Number: R0603_169R_0.1%_0.063W_10PPM; Case: 0603; Mounted: Yes; Sense: No; Socket: No; SMD: Yes; Manufacturer1 Example: TYCO HOLSWORTHY; Manufacturer1 ComponentHeight: 0.5mm; HelpURL: \\cern.ch\dfs\Applications\Altium\Datasheets\R0603_Tyco_RN73.pdf; Author: CERN DEM JLC; CreateDate: 03.12.2007; LatestRevisionDate: 13.03.2008
R60 R61 = R0603_130R_1%_0.1W_100PPM: Resistor - 1%; Manufacturer: GENERIC; Part Description: General Purpose Thick Film Chip Resistor; Manufacturer1 Part Number: NRC06F1300TRF; Power: 0.1W; TC: ±100ppm/°C; PressFit: No; Value: 130; Manufacturer Part Number: R0603_130R_1%_0.1W_100PPM; Part Number: R0603_130R_1%_0.1W_100PPM; Component Kind: Standard; Component Type: Standard; Pin Count: 2; Status: Preferred; Tolerance: ±1%; Case: 0603; Mounted: Yes; Sense: No; Socket: No; SMD: Yes; Manufacturer1 Example: NIC COMPONENT; Manufacturer1 ComponentHeight: 0.55mm; HelpURL: \\cern.ch\dfs\Applications\Altium\Datasheets\R0603_NIC_NRC.pdf; Author: CERN DEM JLC; CreateDate: 03.12.2007; LatestRevisionDate: 13.03.2008
R62 R64 R67 R73 = R0402_10k_1%_0.0625W_100PPM: Resistor - 1%; Manufacturer: GENERIC; Part Description: General Purpose Thick Film Chip Resistor; Manufacturer1 Part Number: 232270671003L; TC: ±100ppm/°C; PressFit: No; Value: 10k; Manufacturer Part Number: R0402_10K_1%_0.0625W_100PPM; Part Number: R0402_10K_1%_0.0625W_100PPM; Component Kind: Standard; Component Type: Standard; Pin Count: 2; Status: Not Recommended; Power: 0.0625W; Tolerance: ±1%; Case: 0402; Mounted: Yes; Sense: No; Socket: No; SMD: Yes; Manufacturer1 Example: YAGEO PHYCOMP; Manufacturer1 ComponentHeight: 0.4mm; HelpURL: \\cern.ch\dfs\Applications\Altium\Datasheets\R0402_Phycomp_RC0402.pdf; Author: CERN DEM JLC; CreateDate: 03.12.2007; LatestRevisionDate: 17.10.2012
R68 = R0603_20K_1%_0.1W_100PPM: Resistor - 1%; Part Description: General Purpose Thick Film Chip Resistor; Manufacturer: GENERIC; Manufacturer1 Part Number: NRC06F2002TRF; Power: 0.1W; TC: ±100ppm/°C; PressFit: No; Part Number: R0603_20K_1%_0.1W_100PPM; Component Kind: Standard; Component Type: Standard; Pin Count: 2; Value: 20k; Status: Preferred; Tolerance: ±1%; Manufacturer Part Number: R0603_20K_1%_0.1W_100PPM; Case: 0603; Mounted: Yes; Sense: No; Socket: No; SMD: Yes; Manufacturer1 Example: NIC COMPONENT; Manufacturer1 ComponentHeight: 0.55mm; HelpURL: \\cern.ch\dfs\Applications\Altium\Datasheets\R0603_NIC_NRC.pdf; Author: CERN DEM JLC; CreateDate: 03.12.2007; LatestRevisionDate: 13.03.2008

## Assembly variants
std: not fitted C9 C9 C16 C25 J1 J2 R5 R6 R11 R12 R16 R17 R17 R23 R29